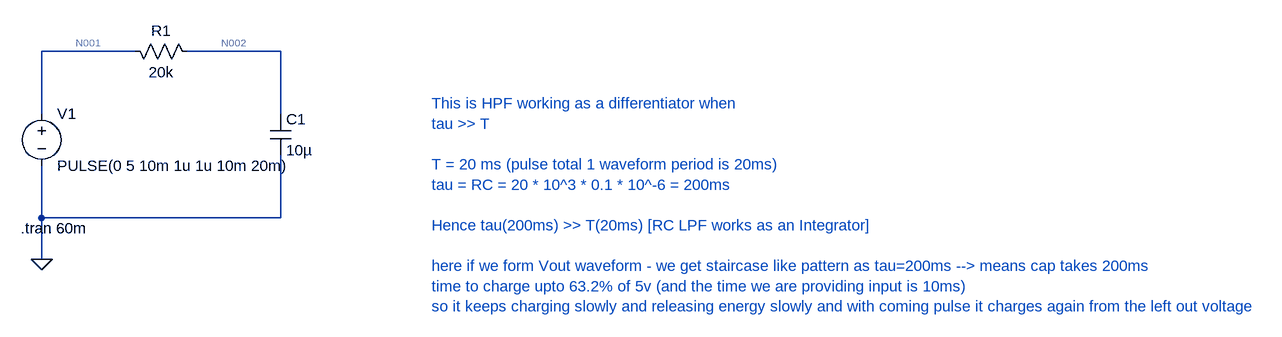
[diagram p0: schematic RC_LPF_as_Integrator.asc]
RC_LPF_as_Integrator.asc, the LTspice schematic file:
Version 4.1
SHEET 1 2420 680
WIRE -192 32 -336 32
WIRE 32 32 -112 32
WIRE -336 128 -336 32
WIRE 32 128 32 32
WIRE -336 288 -336 208
WIRE 32 288 32 192
WIRE 32 288 -336 288
WIRE -336 352 -336 288
FLAG -336 352 0
SYMBOL voltage -336 112 R0
WINDOW 123 0 0 Left 0
WINDOW 39 0 0 Left 0
SYMATTR InstName V1
SYMATTR Value PULSE(0 5 10m 1u 1u 10m 20m)
SYMBOL cap 16 128 R0
SYMATTR InstName C1
SYMATTR Value 10µ
SYMBOL res -208 16 M90
WINDOW 0 0 56 VBottom 2
WINDOW 3 32 56 VTop 2
SYMATTR InstName R1
SYMATTR Value 20k
TEXT 264 112 Left 2 ;This is HPF working as a differentiator when\ntau >> T\n \nT = 20 ms (pulse total 1 waveform period is 20ms)\ntau = RC = 20 * 10^3 * 0.1 * 10^-6 = 200ms\n \nHence tau(200ms) >> T(20ms) [RC LPF works as an Integrator]\n \nhere if we form Vout waveform - we get staircase like pattern as tau=200ms --> means cap takes 200ms \ntime to charge upto 63.2% of 5v (and the time we are providing input is 10ms) \nso it keeps charging slowly and releasing energy slowly and with coming pulse it charges again from the left out voltage
TEXT -368 304 Left 2 !.tran 60m

The netlist it stands for:
* RC_LPF_as_Integrator.asc
V1 N001 0 PULSE(0 5 10m 1u 1u 10m 20m)
C1 N002 0 10µ
R1 N001 N002 20k
* This is HPF working as a differentiator when
* tau >> T
* T = 20 ms (pulse total 1 waveform period is 20ms)
* tau = RC = 20 * 10^3 * 0.1 * 10^-6 = 200ms
* Hence tau(200ms) >> T(20ms) [RC LPF works as an Integrator]
* here if we form Vout waveform - we get staircase like pattern as tau=200ms --> means cap takes 200ms
* time to charge upto 63.2% of 5v (and the time we are providing input is 10ms)
* so it keeps charging slowly and releasing energy slowly and with coming pulse it charges again from the left out voltage
.tran 60m
.backanno
.end

* Results of the author's LTspice run, read from the files saved beside the schematic
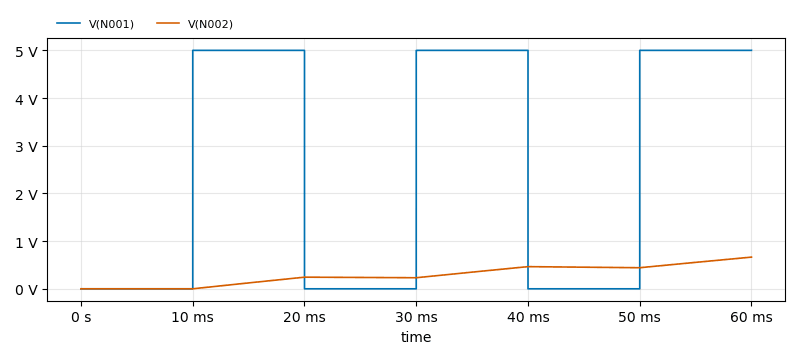
[diagram p1: Transient Analysis of RC_LPF_as_Integrator.asc, plotted from the saved traces]
* Transient Analysis, 1 run:
*   V(N001): min 0 V, max 5 V, average 2.5 V, rms 3.536 V, last 5 V
*   V(N002): min 0 V, max 664.2 mV, average 286.1 mV, rms 347.9 mV, last 664.2 mV